# EasyEDA Pro project 光磁共振实验仪.eprj, board FD-OPMR-A3
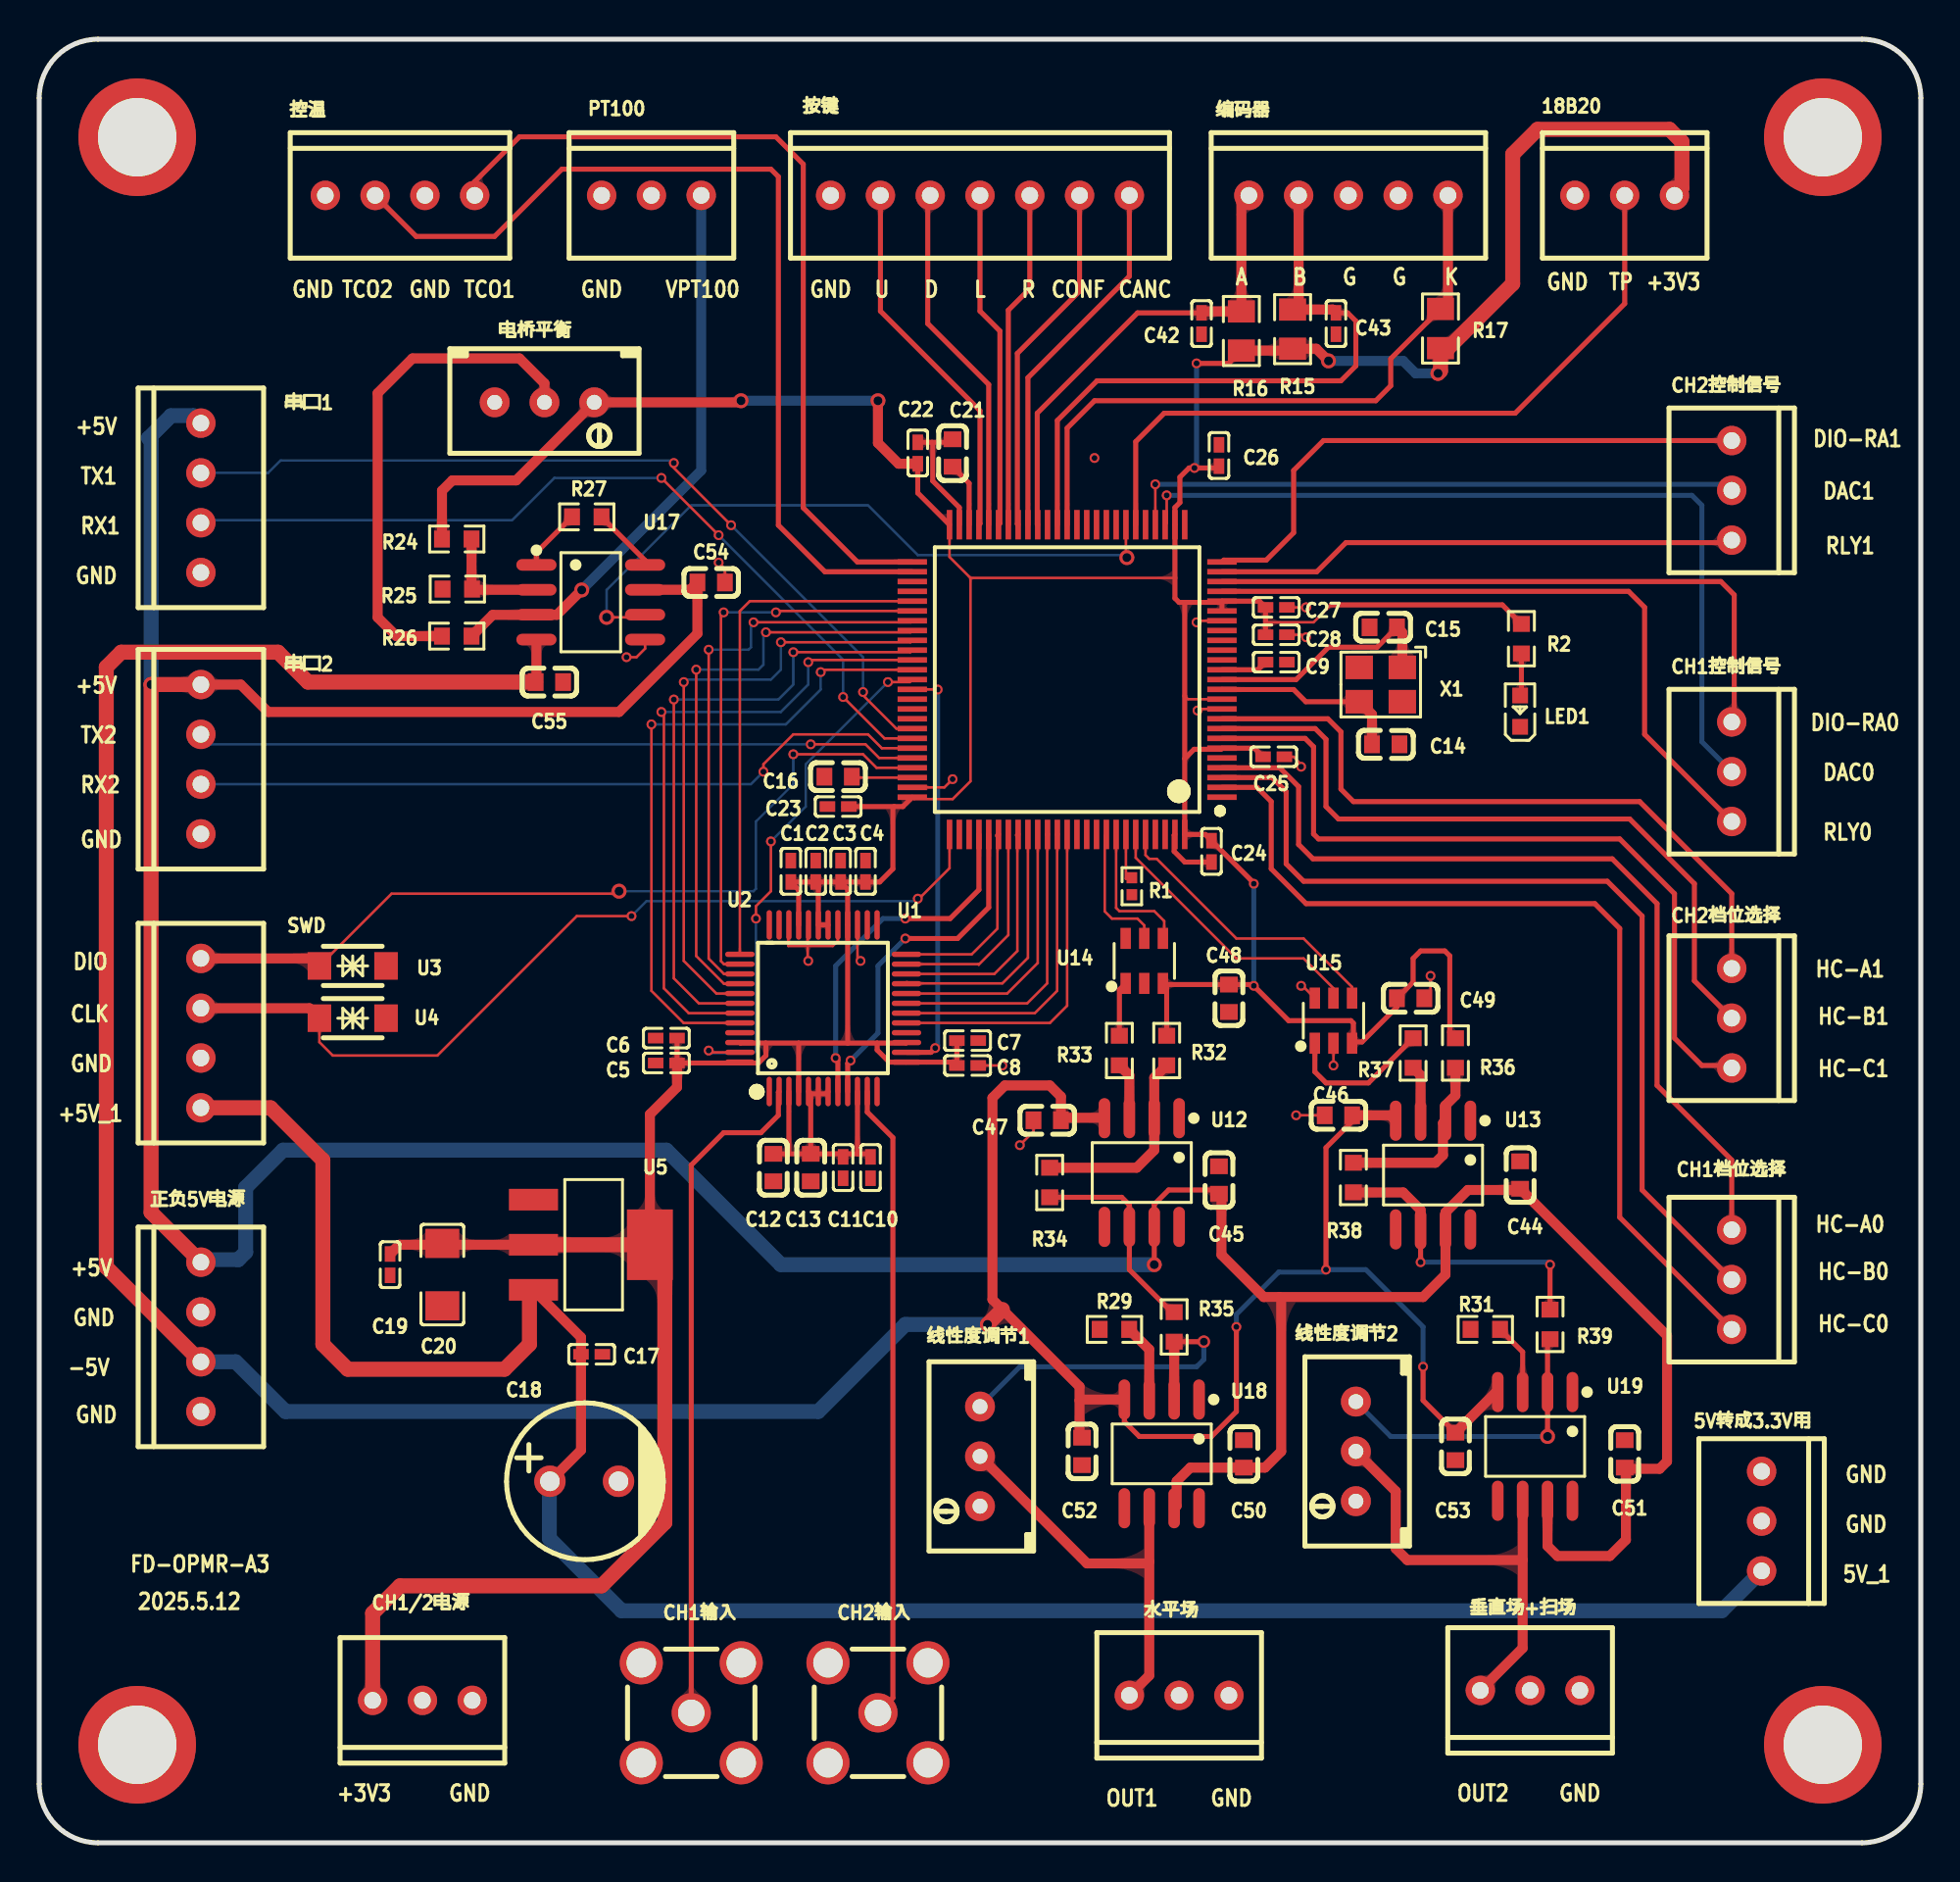
[diagram p7: board, top side]
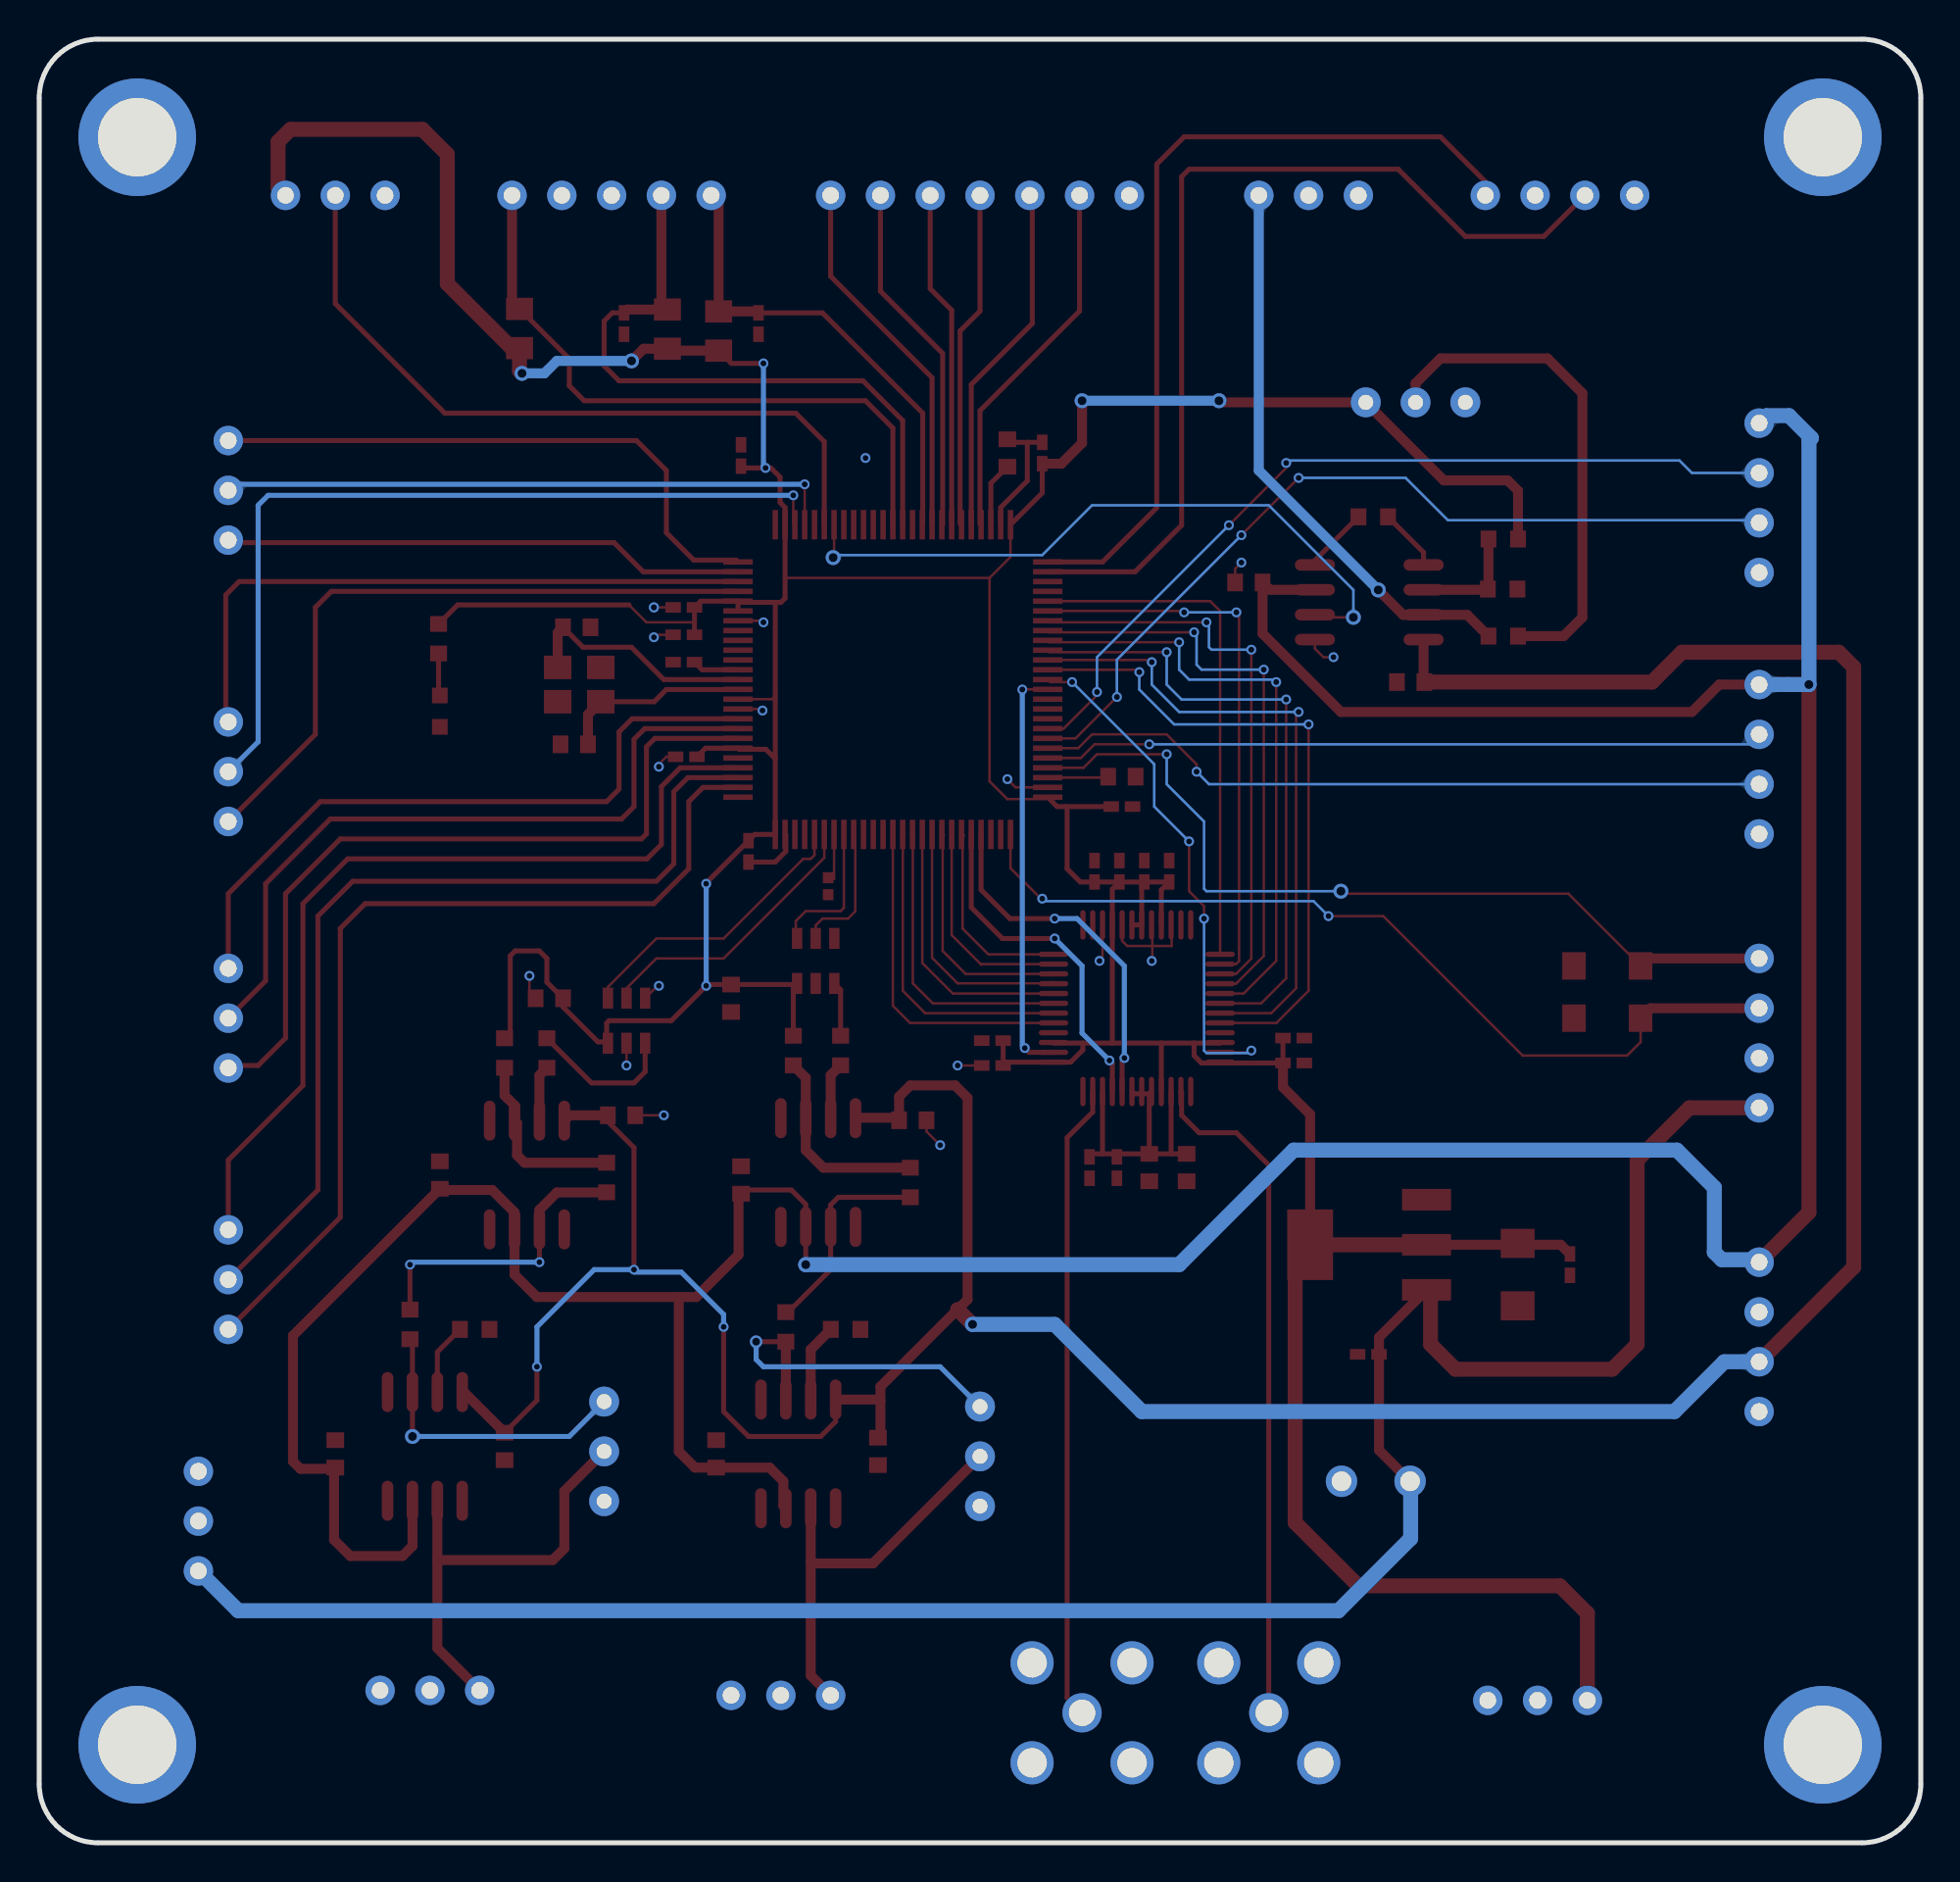
[diagram p8: board, bottom side, seen from below]

Outline 96 x 92 mm; copper layers: Top Layer, Bottom Layer. Coordinates in mm from the lower left corner of the outline.
Outline path: 0,89 0,3 arc(0.88,0.88) 3,0 93,0 arc(95.12,0.88) 96,3 96,89 arc(95.12,91.12) 93,92 3,92 arc(0.88,91.12) 0,89
Stack: Top Layer 0.035mm / Dielectric1 1.51mm FR4 er 4.5 / Bottom Layer 0.035mm

## Design rules (mm)
template: 自定义配置
spacing copperThickness1oz (default): track to track 0.102, other pairs 0.152 to 0.3
spacing copperThickness2oz: track to track 0.203, other pairs 0.152 to 0.3
track width copperThickness1oz (default): min 0.127, default 0.254, max 2.54
track width copperThickness2oz: min 0.203, default 0.254, max 2.54
track width VCCandGND: min 0.127, default 0.762, max 2.54
differential pair differentialPair (default): width min 0.127, default 0.254, max 2.54; gap min 0.152, default 0.152
via viaSize (default): diameter min 0.5, default 0.61, max 10; hole min 0.3, default 0.305, max 6.299

## Placement (name value [footprint] x y rotation side)
5V转成3.3V用  -  [CH2.54-3插座]  87.88 16.41 270 top
18B20  -  [CH2.54-3插座]  80.89 84.03 0 top
C1  100nF  [C0402]  38.35 49.56 270 top
C2  100nF  [C0402]  39.62 49.56 270 top
C3  100nF  [C0402]  40.89 49.56 270 top
C4  100nF  [C0402]  42.16 49.56 270 top
C5  100nF  [C0402]  32 39.78 0 top
C6  100nF  [C0402]  32 41.05 0 top
C7  100nF  [C0402]  47.37 40.92 180 top
C8  100nF  [C0402]  47.37 39.65 180 top
C9  100nF  [C0402]  63.11 60.22 0 top
C10  100nF  [C0402]  42.41 34.44 90 top
C11  100nF  [C0402]  41.01 34.44 90 top
C12  22uF  [C0603]  37.46 34.44 90 top
C13  22uF  [C0603]  39.36 34.44 90 top
C14  22pF  [C0603]  68.7 56.03 180 top
C15  22pF  [C0603]  68.57 62 0 top
C16  22uF  [C0603]  40.76 54.38 0 top
C17  100nF  [C0402]  28.19 24.92 180 top
C18  470uF  [cap-th_bd8.0-p3.50-d0.6-fd_1]  27.81 18.44 0 top
C19  100nF  [C0402]  17.9 29.49 90 top
C20  100uF  [C1206]  20.57 28.98 90 top
C21  22uF  [C0603]  46.6 70.89 90 top
C22  100nF  [C0402]  44.82 70.89 270 top
C23  100nF  [C0402]  40.76 52.86 0 top
C24  100nF  [C0402]  59.81 50.57 90 top
C25  100nF  [C0402]  62.99 55.4 180 top
C26  100nF  [C0402]  60.19 70.77 270 top
C27  100nF  [C0402]  63.11 63.02 180 top
C28  100nF  [C0402]  63.11 61.62 180 top
C42  100nF  [C0402]  59.3 77.5 90 top
C43  100nF  [C0402]  66.16 77.5 90 top
C44  100nF  [C0603]  75.56 34.06 270 top
C45  100nF  [C0603]  60.19 33.81 270 top
C46  100nF  [C0603]  66.29 37.11 0 top
C47  100nF  [C0603]  51.43 36.86 0 top
C48  100nF  [C0603]  60.7 43.08 90 top
C49  100nF  [C0603]  69.97 43.08 180 top
C50  100nF  [C0603]  61.46 19.84 270 top
C51  100nF  [C0603]  80.89 19.84 270 top
C52  100nF  [C0603]  53.21 19.97 90 top
C53  100nF  [C0603]  72.26 20.22 90 top
C54  100nF  [C0603]  34.28 64.29 180 top
C55  100nF  [C0603]  26.03 59.21 180 top
CH1/2电源  -  [CH2.54-3插座]  19.55 7.26 180 top
CH1控制信号  -  [CH2.54-3插座]  86.35 54.64 270 top
CH1档位选择  -  [CH2.54-3插座]  86.35 28.73 270 top
CH1输入  BWSMA-KE-Z001  [SMA-TH_BWSMA-KE-Z001]  33.27 6.63 0 top
CH2控制信号  -  [CH2.54-3插座]  86.35 68.99 270 top
CH2档位选择  -  [CH2.54-3插座]  86.35 42.06 270 top
CH2输入  BWSMA-KE-Z001  [SMA-TH_BWSMA-KE-Z001]  42.79 6.63 0 top
LED1  KT-0603R  [LED0603-RD]  75.56 57.72 90 top
NOREF  -  [Pad_e108]  91 87 0 top
NOREF#2  -  [Pad_e111]  91 5 0 top
NOREF#3  -  [Pad_e110]  5 5 0 top
NOREF#4  -  [Pad_e109]  5 87 0 top
PT100  PT100  [CH2.54-3插座]  31.24 84.03 0 top
R1  10kΩ  [R0402]  55.75 48.79 270 top
R2  5.1kΩ  [R0603]  75.62 61.42 270 top
R15  10kΩ  [R0805]  63.95 77.21 270 top
R16  10kΩ  [R0805]  61.34 77.11 270 top
R17  10kΩ  [R0805]  71.5 77.24 270 top
R24  200Ω  [R0603]  21.3 66.5 180 top
R25  100Ω  [R0603]  21.33 63.95 0 top
R26  20Ω  [R0603]  21.3 61.55 180 top
R27  6.2kΩ  [R0603]  27.94 67.64 180 top
R29  510Ω  [R0603]  54.86 26.19 0 top
R31  510Ω  [R0603]  73.78 26.19 0 top
R32  1kΩ  [R0603]  57.53 40.41 270 top
R33  1kΩ  [R0603]  55.11 40.41 270 top
R34  1kΩ  [R0603]  51.56 33.68 270 top
R35  1kΩ  [R0603]  57.91 26.31 270 top
R36  1kΩ  [R0603]  72.26 40.28 270 top
R37  1kΩ  [R0603]  70.1 40.28 270 top
R38  1kΩ  [R0603]  67.05 33.94 270 top
R39  1kΩ  [R0603]  77.08 26.44 270 top
SWD  SWD  [CH2.54-4插座]  8.25 41.3 90 top
U1  STM32H750VBT6TR  [QFP-100_L14.0-W14.0-P0.50-LS16.0-BL]  52.44 59.33 90 top
U2  AD9288BSTZ-100  [LQFP-48_L7.0-W7.0-P0.50-LS9.0-BL]  40 42.57 0 top
U3  SMF7.5CA  [SOD-123FL_L2.8-W1.8-LS3.7-BI]  16 44.73 0 top
U4  SMF7.5CA  [SOD-123FL_L2.8-W1.8-LS3.7-BI]  16 42.06 0 top
U5  AMS1117-3.3  [SOT-223-3_L6.5-W3.4-P2.30-LS7.0-BR]  28.19 30.51 180 top
U12  OP07CDR  [SOIC-8_L4.9-W3.9-P1.27-LS6.0-BL]  56.25 34.19 180 top
U13  OP07CDR  [SOIC-8_L4.9-W3.9-P1.27-LS6.0-BL]  71.11 34.06 180 top
U14  MCP4725A0T-E/CH  [SOT-23-6_L2.9-W1.6-P0.95-LS2.8-BL]  56.38 44.98 0 top
U15  MCP4725A0T-E/CH  [SOT-23-6_L2.9-W1.6-P0.95-LS2.8-BL]  66.03 41.94 0 top
U17  AD620ARZ  [SOIC-8_L4.9-W3.9-P1.27-LS6.0-BL]  28.14 63.28 270 top
U18  OP07CDR  [SOIC-8_L4.9-W3.9-P1.27-LS6.0-BL]  57.27 19.84 180 top
U19  OP07CDR  [SOIC-8_L4.9-W3.9-P1.27-LS6.0-BL]  76.32 20.22 180 top
X1  25MHz  [OSC-SMD_4P-L3.2-W2.5-BL]  68.45 59.08 180 top
串口1  -  [CH2.54-4插座]  8.25 68.61 90 top
串口2  -  [CH2.54-4插座]  8.25 55.27 90 top
垂直场+扫场  -  [CH2.54-3插座]  76.07 7.77 180 top
按键  -  [CH2.54-7插座]  48 84.03 0 top
控温  -  [CH2.54-4插座]  18.41 84.03 0 top
正负5V电源  -  [CH2.54-4插座]  8.25 25.81 90 top
水平场  -  [CH2.54-3插座]  58.16 7.52 180 top
电桥平衡  500Ω  [RES-ADJ-TH_3296W]  25.78 73.48 270 top
线性度调节1  2kΩ  [RES-ADJ-TH_3296W]  48 19.71 180 top
线性度调节2  2kΩ  [RES-ADJ-TH_3296W]  67.18 19.97 180 top
编码器  -  [CH2.54-5插座]  66.8 84.03 0 top

## Footprints (pads in the part's own frame, mm; a bottom-side part is the same pattern mirrored in y, then rotated)
C0402
  rect 0.79x0.54 smd: 1(-0.545,0) 2(0.545,0)
C0603
  rect 0.8x0.9 smd: 1(-0.7,0) 2(0.7,0)
C1206
  rect 1.485x1.728 smd: 1(-1.593,0) 2(1.593,0)
cap-th_bd8.0-p3.50-d0.6-fd_1
  round 1.6 hole 1: 1(-1.75,0) 2(1.75,0)
CH2.54-3插座
  round 1.5 hole 0.85: 1(-2.54,0) 2(0,0) 3(2.54,0)
CH2.54-4插座
  round 1.5 hole 0.85: 1(-3.81,0) 2(-1.27,0) 3(1.27,0) 4(3.81,0)
CH2.54-5插座
  round 1.5 hole 0.85: 1(-5.08,0) 2(-2.54,0) 3(0,0) 4(2.54,0) 5(5.08,0)
CH2.54-7插座
  round 1.5 hole 0.85: 1(-7.62,0) 2(-5.08,0) 3(-2.54,0) 4(0,0) 5(2.54,0) 6(5.08,0) 7(7.62,0)
LED0603-RD
  rect 0.8x0.8 smd: 1(-0.799,0) 2(0.799,0)
LQFP-48_L7.0-W7.0-P0.50-LS9.0-BL
  oval 0.27x1.5 smd: 1(-2.75,-4.25) 2(-2.25,-4.25) 3(-1.75,-4.25) 4(-1.25,-4.25) 5(-0.75,-4.25) 6(-0.25,-4.25) 7(0.25,-4.25) 8(0.75,-4.25) 9(1.25,-4.25) 10(1.75,-4.25) 11(2.25,-4.25) 12(2.75,-4.25) 25(2.75,4.25) 26(2.25,4.25) 27(1.75,4.25) 28(1.25,4.25) 29(0.75,4.25) 30(0.25,4.25) 31(-0.25,4.25) 32(-0.75,4.25) 33(-1.25,4.25) 34(-1.75,4.25) 35(-2.25,4.25) 36(-2.75,4.25)
  oval 1.5x0.27 smd: 13(4.25,-2.75) 14(4.25,-2.25) 15(4.25,-1.75) 16(4.25,-1.25) 17(4.25,-0.75) 18(4.25,-0.25) 19(4.25,0.25) 20(4.25,0.75) 21(4.25,1.25) 22(4.25,1.75) 23(4.25,2.25) 24(4.25,2.75) 37(-4.25,2.75) 38(-4.25,2.25) 39(-4.25,1.75) 40(-4.25,1.25) 41(-4.25,0.75) 42(-4.25,0.25) 43(-4.25,-0.25) 44(-4.25,-0.75) 45(-4.25,-1.25) 46(-4.25,-1.75) 47(-4.25,-2.25) 48(-4.25,-2.75)
OSC-SMD_4P-L3.2-W2.5-BL
  rect 1.4x1.2 smd: 1(-1.1,-0.875) 2(1.1,-0.875) 3(1.1,0.875) 4(-1.1,0.875)
Pad_e108
  round 6 hole 4: 2(0,0)
Pad_e109
  round 6 hole 4: 2(0,0)
Pad_e110
  round 6 hole 4: 2(0,0)
Pad_e111
  round 6 hole 4: 2(0,0)
QFP-100_L14.0-W14.0-P0.50-LS16.0-BL
  rect 0.28x1.5 smd: 1(-6,-7.9) 2(-5.5,-7.9) 3(-5,-7.9) 4(-4.5,-7.9) 5(-4,-7.9) 6(-3.5,-7.9) 7(-3,-7.9) 8(-2.5,-7.9) 9(-2,-7.9) 10(-1.5,-7.9) 11(-1,-7.9) 12(-0.5,-7.9) 13(0,-7.9) 14(0.5,-7.9) 15(1,-7.9) 16(1.5,-7.9) 17(2,-7.9) 18(2.5,-7.9) 19(3,-7.9) 20(3.5,-7.9) 21(4,-7.9) 22(4.5,-7.9) 23(5,-7.9) 24(5.5,-7.9) 25(6,-7.9) 51(6,7.9) 52(5.5,7.9) 53(5,7.9) 54(4.5,7.9) 55(4,7.9) 56(3.5,7.9) 57(3,7.9) 58(2.5,7.9) 59(2,7.9) 60(1.5,7.9) 61(1,7.9) 62(0.5,7.9) 63(0,7.9) 64(-0.5,7.9) 65(-1,7.9) 66(-1.5,7.9) 67(-2,7.9) 68(-2.5,7.9) 69(-3,7.9) 70(-3.5,7.9) 71(-4,7.9) 72(-4.5,7.9) 73(-5,7.9) 74(-5.5,7.9) 75(-6,7.9)
  rect 1.5x0.28 smd: 26(7.9,-6) 27(7.9,-5.5) 28(7.9,-5) 29(7.9,-4.5) 30(7.9,-4) 31(7.9,-3.5) 32(7.9,-3) 33(7.9,-2.5) 34(7.9,-2) 35(7.9,-1.5) 36(7.9,-1) 37(7.9,-0.5) 38(7.9,0) 39(7.9,0.5) 40(7.9,1) 41(7.9,1.5) 42(7.9,2) 43(7.9,2.5) 44(7.9,3) 45(7.9,3.5) 46(7.9,4) 47(7.9,4.5) 48(7.9,5) 49(7.9,5.5) 50(7.9,6) 76(-7.9,6) 77(-7.9,5.5) 78(-7.9,5) 79(-7.9,4.5) 80(-7.9,4) 81(-7.9,3.5) 82(-7.9,3) 83(-7.9,2.5) 84(-7.9,2) 85(-7.9,1.5) 86(-7.9,1) 87(-7.9,0.5) 88(-7.9,0) 89(-7.9,-0.5) 90(-7.9,-1) 91(-7.9,-1.5) 92(-7.9,-2) 93(-7.9,-2.5) 94(-7.9,-3) 95(-7.9,-3.5) 96(-7.9,-4) 97(-7.9,-4.5) 98(-7.9,-5) 99(-7.9,-5.5) 100(-7.9,-6)
R0402
  rect 0.566x0.54 smd: 1(-0.433,0) 2(0.433,0)
R0603
  rect 0.806x0.864 smd: 1(-0.753,0) 2(0.753,0)
R0805
  rect 1.133x1.377 smd: 1(-1,0) 2(1,0)
RES-ADJ-TH_3296W
  round 1.524 hole 0.762: 1(0,2.54) 2(0,0) 3(0,-2.54)
SMA-TH_BWSMA-KE-Z001
  round 2.2 hole 1.5: 1(-2.55,-2.55) 2(-2.55,2.55) 3(2.55,2.55) 4(2.55,-2.55)
  round 2 hole 1.35: 5(0,0)
SOD-123FL_L2.8-W1.8-LS3.7-BI
  rect 1.2x1.4 smd: 1(-1.7,0) 2(1.7,0)
SOIC-8_L4.9-W3.9-P1.27-LS6.0-BL
  oval 0.588x2.045 smd: 1(-1.905,-2.772) 2(-0.635,-2.772) 3(0.635,-2.772) 4(1.905,-2.772) 5(1.905,2.772) 6(0.635,2.772) 7(-0.635,2.772) 8(-1.905,2.772)
SOT-23-6_L2.9-W1.6-P0.95-LS2.8-BL
  rect 0.532x1.072 smd: 1(-0.95,-1.149) 2(0,-1.149) 3(0.95,-1.149) 4(0.95,1.149) 5(0,1.149) 6(-0.95,1.149)
SOT-223-3_L6.5-W3.4-P2.30-LS7.0-BR
  rect 2.5x1.1 smd: 1(2.97,-2.3) 2(2.97,0) 3(2.97,2.3)
  rect 2.34x3.6 smd: 4(-2.97,0)

## Nets
As in the schematic, except:
+5V_1: 5V转成3.3V用.3 C17.2 C18.1 SWD.1 U5.3
GND: 5V转成3.3V用.1 5V转成3.3V用.2 18B20.1 C1.1 C2.1 C3.1 C4.1 C5.1 C6.1 C7.1 C8.1 C9.2 C10.1 C11.1 C12.1 C13.1 C14.1 C15.1 C16.1 C17.1 C18.2 C19.1 C20.1 C21.2 C22.1 C23.1 C24.1 C25.1 C26.1 C27.1 C28.1 C42.1 C43.1 C44.1 C45.1 C46.1 C47.1 C48.1 C49.1 C50.1 C51.1 C52.1 C53.1 C54.1 C55.1 CH1/2电源.1 CH1/2电源.2 CH1输入.1 CH1输入.2 CH1输入.3 CH1输入.4 CH2输入.1 CH2输入.2 CH2输入.3 CH2输入.4 LED1.1 NOREF.2 NOREF#2.2 NOREF#3.2 NOREF#4.2 PT100.1 PT100.2 R1.2 R25.1 R29.1 R31.1 SWD.2 U1.10 U1.19 U1.26 U1.49 U1.74 U1.99 U2.1 U2.12 U2.16 U2.27 U2.29 U2.32 U2.34 U2.45 U3.2 U4.2 U5.1 U14.2 U14.6 U15.2 U15.6 U17.5 X1.2 X1.4 串口1.1 串口2.1 垂直场+扫场.1 垂直场+扫场.2 按键.1 控温.1 控温.3 正负5V电源.1 正负5V电源.3 水平场.1 水平场.2 编码器.3 编码器.4
CLK: SWD.3 U1.76 U4.1
DIO: SWD.4 U1.72 U3.1
HC-A0: CH1档位选择.1 U1.4
HC-A1: CH2档位选择.1 U1.9
HC-C0: CH1档位选择.3 U1.2
HC-C1: CH2档位选择.3 U1.7

Pads without a net: U1 1 5 15 16 17 18 33 34 35 36 37 40 53 54 65 66 67 77 78 89 90 91 97 98; U2 25 26 35 36; U12 1 5 8; U13 1 5 8; U18 1 5 8; U19 1 5 8; 电桥平衡 3; 线性度调节1 1; 线性度调节2 1

## Via types
v1: diameter 0.5, hole 0.3, Top Layer to Bottom Layer, 33 vias
v2: diameter 0.5, hole 0.305, Top Layer to Bottom Layer, 31 vias
v3: diameter 0.762, hole 0.457, Top Layer to Bottom Layer, 12 vias
v4: diameter 0.635, hole 0.406, Top Layer to Bottom Layer, 1 via

## Routing (per net, layer and track width the routed paths; a pad name or vN(x,y) marks a point on that pad's centre or on a via; arc(x,y) is an arc through that point)
+3V3: length 298.4
  Top Layer w0.127: 58.44,58.5 58.61,58.33 U1.11 ; 47.51,64.52 57.94,64.52 ; 47.51,64.52 47.51,54.15 46.6,53.24 44.64,53.24 U1.75 ; 47.51,64.52 46.44,65.59 U1.50 ; 65.91,63.14 65.02,62.26 62.62,62.26 62.57,62.31
  Top Layer w0.254: 35.71,39.78 36.7,39.78 37.08,40.16 37.08,40.78 37.07,40.79 ; 35.71,39.78 U2.48 ; 35.71,39.78 32.54,39.78 32.54,41.05 ; 43.62,52.86 41.05,52.86 ; 43.62,52.86 44.07,52.86 U1.75 ; 43.62,52.86 43.56,52.8 43.56,49.68 42.88,49.01 C4.2 C3.2 ; 57.39,43.78 57.53,43.64 R32.1 ; 57.39,43.78 C48.2 61.91,43.78 v1(61.97,43.71) 63.75,41.94 66.92,41.94 67.05,41.81 67.05,40.85 ; 57.39,43.78 U14.3 ; U2.30 U2.31 39.75,48.88 C2.2 ; C28.2 C27.2 62.25,63.33 U1.21 ; 58.44,55.3 58.92,55.78 60.29,55.78 U1.6 62,55.83 C25.2 ; 58.44,55.3 58.44,63.25 58.46,63.27 ; 58.44,55.3 58.44,51.44 59.49,51.44 C24.2 61.97,48.96 v1(61.97,48.92) ; 42.75,40.79 44.22,40.79 U2.15 ; 42.75,40.79 41.25,40.79 ; 42.75,40.79 42.75,40.44 43.37,39.82 U2.13 46.65,39.82 C8.2 C7.2 ; 38.75,40.79 41.25,40.79 ; 38.75,40.79 37.07,40.79 ; 38.75,40.79 U2.4 ; 41.25,40.79 U2.28 41.25,48.65 C3.2 ; C2.2 C3.2 ; C2.2 C1.2 38.75,48.61 U2.33 ; U1.21 U1.20 ; U1.21 60.28,63.27 58.46,63.27 ; 65.91,63.14 74.65,63.14 R2.1 ; 37.07,40.79 35.78,40.79 U2.46 ; 67.05,40.85 U15.3 ; 67.05,40.85 67.49,40.85 69.27,42.63 69.27,43.07 ; C22.2 44.82,68.86 U1.50 ; 58.46,63.27 58.16,63.27 57.94,63.49 U1.27 57.94,68.11 58.2,68.37 58.2,69.66 58.67,70.13 v2(58.94,70.13) 60.1,70.13 C26.2 ; v2(59.05,75.46) 60.68,75.46 R16.2 ; 69.27,43.07 70.1,43.9 70.1,45.11 70.48,45.49 71.72,45.49 71.97,45.24 71.97,41.33 R36.1 ; 69.27,43.07 C49.2
  Top Layer w0.508: v3(35.81,73.56) 35.73,73.48 电桥平衡.1 24.34,69.5 21.08,69.5 20.55,68.97 R24.2 ; v3(65.78,75.59) 65.16,76.21 R15.2 63.85,76.11 R16.2 ; U5.4 31.16,37.16 32.54,38.54 32.54,39.78 ; U5.2 18.37,30.51 C19.2 ; C22.2 43.85,70.35 42.79,71.4 v3(42.79,73.56)
  Top Layer w0.762: 18B20.3 83.81,84.41 83.81,86.77 83.18,87.4 76.45,87.4 75.18,86.13 75.18,79.53 71.89,76.24 R17.2 71.5,75.08 v3(71.37,74.96) ; U5.2 U5.4 31.92,29.74 31.92,16.33 28.7,13.11 18.41,13.11 17.01,11.71 CH1/2电源.3
  Bottom Layer w0.254: v2(59.05,75.46) 59.05,70.24 v2(58.94,70.13) ; v1(61.97,48.92) v1(61.97,43.71)
  Bottom Layer w0.508: v3(35.81,73.56) v3(42.79,73.56) ; v3(71.37,74.96) 70.22,74.96 69.59,75.59 v3(65.78,75.59)
+5V: length 215.2
  Top Layer w0.254: v3(56.89,29.49) U12.7 56.89,32.57 57.62,33.3 60,33.3 C45.2
  Top Layer w0.508: C45.2 60.32,32.98 60.32,30 62.48,27.84 63.28,27.84 ; 80.96,19.08 82.67,19.08 83.05,19.46 83.05,25.87 C44.2 75.5,33.3 72.89,33.3 71.75,32.16 U13.7 71.75,28.98 70.61,27.84 63.28,27.84 ; 80.96,19.08 80.96,15.46 80.13,14.63 77.46,14.63 76.96,15.14 U19.7 ; 80.96,19.08 C51.2 ; 63.28,27.84 63.37,27.75 63.37,19.97 62.54,19.14 C50.2 58.73,19.14 58.03,18.44 58.03,17.19 U18.7 ; U17.7 33.21,63.92 C54.2 33.58,61.68 29.59,57.68 11.68,57.68 10.28,59.08 串口2.4
  Top Layer w0.762: 正负5V电源.4 5.71,32.16 v3(5.71,59.08) 串口2.4
  Bottom Layer w0.762: 串口1.4 7.87,72.8 6.72,72.8 5.58,71.65 5.71,71.53 v3(5.71,59.08) 串口2.4 ; 正负5V电源.4 8.38,29.74 10.15,29.74 10.53,30.12 10.53,33.43 12.44,35.33 32,35.33 37.84,29.49 v3(56.89,29.49)
+5V_1: length 109.8
  Top Layer w0.508: C18.1 27.64,20.03 C17.2 27.64,25.78 U5.3
  Top Layer w0.762: SWD.1 11.81,37.49 14.47,34.82 14.47,25.43 15.74,24.16 23.74,24.16 25.01,25.43 25.01,28 U5.3
  Bottom Layer w0.762: C18.1 26.03,18.41 26.03,15.52 29.71,11.84 85.85,11.84 5V转成3.3V用.3
-5V: length 179.7
  Top Layer w0.254: v1(61.08,26.31) 61.08,22 59.81,20.73 56.13,20.73 55.37,21.49 U18.4 ; v1(65.65,29.24) 65.65,35.46 66.99,36.79 C46.2 ; v1(70.61,24.28) 70.61,22.57 72.26,20.92
  Top Layer w0.508: C55.2 25.37,59.25 U17.4 ; C52.2 53.08,20.79 53.08,22.56 ; 53.08,22.56 53.13,22.61 U18.4 ; 53.08,22.56 53.08,23.27 48.63,27.71 48.63,38 49.27,38.63 51.56,38.63 52.13,38.06 C47.2 52.26,36.98 54.33,36.98 U12.4 ; U19.4 74.33,22.99 72.26,20.92 ; C46.2 68.93,37.11 U13.4
  Top Layer w0.762: v3(48.38,26.44) 49.14,27.2 ; C55.2 13.71,59.21 12.19,60.73 4.19,60.73 3.42,59.97 3.42,29.36 正负5V电源.2
  Bottom Layer w0.254: v1(61.08,26.31) 61.08,26.95 63.24,29.11 65.65,29.11 ; v1(70.61,24.28) 70.61,26.31 67.69,29.24 v1(65.65,29.24)
  Bottom Layer w0.762: v3(48.38,26.44) 44.19,26.44 39.75,22 12.57,22 10.03,24.54 正负5V电源.2
GND: length 36
  Top Layer w0.127: U1.19 59.13,62.33 v2(59.05,62.26) ; 29.84,60.48 v1(29.97,60.48) 30.47,60.48 30.91,60.92 U17.5 ; C54.1 34.98,64.98 v1(34.66,65.3) ; v1(39.24,44.98) 39.21,45.01 39.21,45.75 ; v1(70.99,44.22) 70.99,43.39 C49.1 ; U15.2 v1(66.03,39.65) ; U2.29 40.75,46.01 40.49,45.75 39.21,45.75 ; 41.78,44.98 41.75,45.01 U2.27 ; 65.08,43.08 64.46,43.71 v1(64.38,43.71) ; v1(50.03,35.59) 50.73,36.28 C47.1 ; 39.21,45.75 38.22,45.75 38.22,46.79 U2.34 ; 39.21,45.75 39.21,46.78 U2.32 ; 64.26,55.14 64,55.4 63.53,55.4 ; C46.1 v1(64.13,37.11) ; v1(46.6,54.25) 46.18,53.83 U1.74 ; U1.10 59.18,57.83 ; C8.1 v1(49.14,39.65) ; C27.1 v1(64.64,63.02) ; C28.1 64.38,61.62 64.64,61.37
  Top Layer w0.254: 45.55,71.44 45.59,71.4 45.59,69.47 46.94,68.11 U1.49 ; 45.55,71.44 C22.1 ; 45.55,71.44 46.45,71.44 C21.2 ; 57.94,51.44 57.91,51.4 57.91,50.57 58.45,50.03 C24.1
  vias: v1(41.9,44.98) v1(53.84,70.64) v1(64.38,54.89) v1(64.64,61.49) v2(59.1,57.76)
A: length 24.3
  Top Layer w0.254: U1.41 50.92,67.26 50.92,72.92 56.04,78.04 C42.2
  Top Layer w0.508: 编码器.1 61.34,83.65 R16.1 59.38,78.11 C42.2
AD1: length 34.4
  Top Layer w0.127: U1.32 55.44,65.61 v3(55.49,65.56) ; v3(28.95,62.51) 30.78,62.51 U17.6
  Bottom Layer w0.127: 55.37,65.69 44.82,65.69 42.28,68.22 33.27,68.22 28.95,63.91 v3(28.95,62.51)
B: length 33.4
  Top Layer w0.254: C43.2 66.76,78.04 67.18,77.62 67.18,75.34 66.41,74.58 53.97,74.58 51.94,72.55 U1.39
  Top Layer w0.508: 编码器.2 64.26,78.52 R15.1 65.99,78.21 C43.2
CANCEL: length 18.9
  Top Layer w0.254: 按键.7 55.62,79.91 50.44,74.73 U1.42
CH1-OUT: length 34.7
  Top Layer w0.254: CH1输入.5 33.27,34.57 34.92,36.22 36.82,36.22 37.71,37.11 37.71,38.28 U2.2
CH2-OUT: length 32.5
  Top Layer w0.254: CH2输入.5 43.56,7.39 43.56,35.97 42.25,37.27 U2.11
CLK: length 45.6
  Top Layer w0.127: v1(30.22,47.27) 27.43,47.27 20.31,40.16 14.98,40.16 14.3,40.84 U4.1 ; v1(44.82,48.16) 44.89,48.16 46.44,49.71 46.44,51.44
  Top Layer w0.508: U4.1 13.79,42.57 SWD.3
  Bottom Layer w0.127: v1(30.22,47.27) 30.98,48.03 44.7,48.03 v1(44.82,48.16)
CONFIRM: length 18.1
  Top Layer w0.254: 按键.6 53.08,79.15 49.91,75.97 49.91,67.28 U1.43
DA0: length 26.5
  Top Layer w0.127: U1.55 36.25,63.33 35.75,62.83 U2.37
DA1: length 28.5
  Top Layer w0.127: U2.38 34.94,44.82 34.78,44.97 34.78,62.63 v2(34.92,62.76) ; U1.56 37.66,62.83 v2(37.59,62.76)
  Bottom Layer w0.127: v2(37.59,62.76) v2(34.92,62.76)
DA2: length 29.4
  Top Layer w0.127: U1.57 44.47,62.26 v2(36.44,62.26) ; v2(34.16,60.86) 34.16,45.1 34.94,44.32 U2.39
  Bottom Layer w0.127: v2(34.16,60.86) 36.19,60.86 36.32,60.99 36.32,62.38
DA3: length 30.2
  Top Layer w0.127: v2(33.52,59.84) 33.52,45.23 34.94,43.82 U2.40 ; U1.58 44.46,61.75 v2(37.08,61.75)
  Bottom Layer w0.127: v2(33.52,59.84) 36.7,59.84 36.95,60.1 36.95,61.62 v2(37.08,61.75)
DA4: length 31.3
  Top Layer w0.127: 37.71,61.24 v2(37.84,61.24) 44.45,61.24 U1.59 ; U2.41 34.55,43.32 32.89,44.98 v2(32.89,59.21)
  Bottom Layer w0.127: v2(37.84,61.24) 37.84,59.84 37.33,59.33 33.01,59.33 v2(32.89,59.21)
DA5: length 32.3
  Top Layer w0.127: v2(38.47,60.73) 44.44,60.73 U1.60 ; U2.42 33.65,42.82 32.38,44.09 v2(32.38,58.32)
  Bottom Layer w0.127: v2(38.47,60.73) 38.47,59.08 37.71,58.32 v2(32.38,58.32)
DA6: length 33.1
  Top Layer w0.127: v2(31.74,57.68) 31.87,57.56 31.87,43.59 33.14,42.32 U2.43 ; v2(39.24,60.22) 39.35,60.33 U1.61
  Bottom Layer w0.127: v2(31.74,57.68) 37.84,57.68 39.24,59.08 v2(39.24,60.22)
DA7: length 33.8
  Top Layer w0.127: U1.62 39.99,59.83 v2(39.87,59.72) ; v2(31.24,57.05) 31.24,43.46 32.88,41.82 U2.44
  Bottom Layer w0.127: v2(31.24,57.05) 38.09,57.05 39.87,58.83 v2(39.87,59.72)
DAC0: length 43.3
  Top Layer w0.127: U1.28 57.53,67.31 v2(57.53,68.73)
  Bottom Layer w0.254: v2(57.53,68.73) 84.32,68.73 84.83,68.22 84.83,56.16 CH1控制信号.2
DAC1: length 31.7
  Top Layer w0.127: U1.29 v2(56.94,69.3)
  Top Layer w0.254: v2(56.94,69.3) 57.02,69.37
  Bottom Layer w0.254: CH2控制信号.2 86.04,69.3 v2(56.94,69.3)
DAC2: length 2.8
  Top Layer w0.254: R33.1 55.11,43.52 U14.1
DAC3: length 7.7
  Top Layer w0.254: U15.1 65.08,39.33 65.65,38.76 67.82,38.76 R37.1
DB0: length 10
  Top Layer w0.127: 48.89,51.38 48.89,46.64 47.57,45.32 U2.24
  Top Layer w0.254: 48.89,51.38 48.94,51.44
DB1: length 11
  Top Layer w0.127: U2.23 47.91,44.82 47.94,44.79 49.44,46.3 49.44,51.44
DB2: length 12.1
  Top Layer w0.127: 49.91,51.39 49.91,45.49 48.73,44.32 U2.22
  Top Layer w0.254: 49.91,51.39 49.94,51.44
DB3: length 13
  Top Layer w0.127: 50.44,51.44 50.44,45.14 49.14,43.84 44.27,43.84
  Top Layer w0.254: 44.27,43.84 U2.21
DB4: length 13.9
  Top Layer w0.127: U2.20 49.38,43.32 50.94,44.88 50.94,51.44
DB5: length 15.2
  Top Layer w0.127: 51.43,51.42 51.43,43.84 50.41,42.82 U2.19
  Top Layer w0.254: 51.43,51.42 51.44,51.44
DB6: length 16.1
  Top Layer w0.127: 51.94,51.43 51.94,43.46 50.8,42.32 U2.18
  Top Layer w0.254: 51.94,51.43 51.94,51.44
DB7: length 17.3
  Top Layer w0.127: 52.44,51.44 52.44,42.7 51.57,41.82 U2.17
DIO: length 44.1
  Top Layer w0.127: 29.59,48.41 17.98,48.41 U3.1 ; v2(38.47,55.53) 42.03,55.53 42.72,54.83 U1.72
  Top Layer w0.508: U3.1 13.92,45.11 SWD.4
  Bottom Layer w0.127: v2(38.47,55.53) 38.47,54 36.57,52.1 36.57,48.67 36.44,48.54 v3(29.59,48.54)
DIO-CLKA: length 27
  Top Layer w0.127: U1.63 44.42,59.21 v2(43.3,59.21) ; v1(36.57,47.14) 36.57,47.78 37.33,48.54 v1(37.33,51.08) ; v1(34.16,40.41) 34.25,40.32 U2.47
  Bottom Layer w0.127: v1(37.33,51.08) 39.11,52.86 39.11,55.02 v2(43.3,59.21) ; 34.16,40.28 36.44,40.28 36.57,40.41 v1(36.57,47.14)
DIO-CLKB: length 21.2
  Top Layer w0.127: U1.64 45.83,58.83 v2(45.84,58.83)
  Top Layer w0.254: U2.14 45.5,40.32 v1(45.71,40.54)
  Bottom Layer w0.254: v2(45.84,58.83) 45.84,40.67 v1(45.71,40.54)
DIO-RA0: length 32.9
  Top Layer w0.254: CH1控制信号.1 86.48,57.3 86.48,63.65 85.8,64.33 U1.23
DIO-RA1: length 30.4
  Top Layer w0.254: CH2控制信号.1 65.53,71.53 64,70 64,66.83 62.6,65.43 60.44,65.43 U1.25
DIO-S1: length 18.2
  Top Layer w0.254: 47.94,51.44 47.94,48.61 46.48,47.14 v1(44.19,47.14) ; v1(40.63,40.03) 40.75,39.92 U2.8
  Bottom Layer w0.254: v1(44.19,47.14) 43.05,47.14 40.63,44.73 v1(40.63,40.03)
DIO-S2: length 17.7
  Top Layer w0.254: v1(44.19,46.13) 46.86,46.13 48.44,47.72 48.44,51.44 ; U2.9 41.25,39.76 v1(41.4,39.9)
  Bottom Layer w0.254: v1(41.4,39.9) 42.79,41.3 42.79,44.73 v1(44.19,46.13)
DOWN: length 18.1
  Top Layer w0.254: 按键.3 45.33,83.91 45.33,77.5 48.44,74.38 U1.46
HC-A0: length 45
  Top Layer w0.254: CH1档位选择.1 86.35,34.82 82.54,38.63 82.54,47.91 80.26,50.19 64.99,50.19 64.26,50.92 64.26,53.87 63.29,54.83 U1.4
HC-A1: length 35.2
  Top Layer w0.254: U1.9 65.75,57.33 66.41,56.67 66.41,53.75 67.05,53.11 81.66,53.11 86.35,48.41 CH2档位选择.1
HC-B0: length 47
  Top Layer w0.254: U1.3 62.91,54.33 63.62,53.62 63.62,49.94 64.51,49.05 80,49.05 81.78,47.27 81.78,33.3 CH1档位选择.2
HC-B1: length 37
  Top Layer w0.254: CH2档位选择.2 84.45,43.97 84.45,48.92 81.15,52.22 66.29,52.22 65.65,52.86 65.65,56.29 65.1,56.83 U1.8
HC-C0: length 48.1
  Top Layer w0.254: U1.2 62.14,53.83 62.86,53.11 62.86,49.68 64.64,47.91 79.37,47.91 80.64,46.64 80.64,31.9 CH1档位选择.3
HC-C1: length 39.9
  Top Layer w0.254: U1.7 64.59,56.33 65.02,55.91 65.02,51.46 65.27,51.21 80.64,51.21 83.43,48.41 83.43,41.05 84.83,39.65 86.23,39.65 CH2档位选择.3
KEY: length 33.3
  Top Layer w0.254: R17.1 68.96,75.7 68.96,74.32 68.19,73.56 53.84,73.56 52.44,72.16 U1.38
  Top Layer w0.508: R17.1 71.88,78.62 编码器.5
LEFT: length 17.2
  Top Layer w0.254: 按键.4 48,78.13 49.02,77.11 49.02,67.31 U1.45
OSC_IN: length 9.7
  Top Layer w0.254: X1.3 64.62,58.21 64,58.83 60.35,58.83 U1.12
  Top Layer w0.508: X1.3 68,57.55 C14.2
OSC_OUT: length 12.2
  Top Layer w0.254: U1.13 64.13,59.33 65.78,60.99 68.26,60.99 C15.2
  Top Layer w0.508: X1.1 69.55,61.73 C15.2
REFO: length 15.6
  Top Layer w0.254: C13.2 41.76,35.14 ; C13.2 39.36,38.21 ; C13.2 38.2,35.14 ; 41.76,35.14 42.26,35.14 C10.2 ; 41.76,35.14 41.75,35.16 U2.10 ; 39.36,38.21 40.13,38.21 U2.7 ; 39.36,38.21 U2.5 ; 38.2,35.14 38.25,35.19 U2.3 ; 38.2,35.14 C12.2
RIGHT: length 17.3
  Top Layer w0.254: U1.44 49.44,78.18 50.54,79.27 按键.5
RLY0: length 34.7
  Top Layer w0.254: CH1控制信号.3 81.91,56.54 81.91,63.02 81.09,63.83 U1.22
RLY1: length 26.7
  Top Layer w0.254: U1.24 65.18,64.83 66.67,66.32 86.23,66.32 86.35,66.45
RX1: length 43.9
  Top Layer w0.127: U1.69 43.13,56.33 v2(41.01,58.45) ; v2(34.66,66.7) v2(31.74,69.62)
  Bottom Layer w0.127: v2(34.66,66.7) 41.01,60.35 v2(41.01,58.45) ; v2(31.74,69.62) 26.28,69.62 24.12,67.46 8.38,67.46 串口1.2
RX2: length 37.9
  Top Layer w0.127: U1.70 42.99,55.83 42.28,56.54 38.47,56.54 36.95,55.02 v2(36.95,54.64)
  Bottom Layer w0.127: v2(36.95,54.64) 36.32,54 串口2.2
SCL1: length 6.9
  Top Layer w0.127: 54.44,51.44 54.36,51.35 54.36,47.51 54.73,47.14 56.03,47.14 56.38,46.8 U14.5
SCL2: length 14.5
  Top Layer w0.127: 55.94,51.44 55.94,50.25 61.08,45.11 64.51,45.11 66.03,43.59 66.03,43.08
SDA1: length 7.4
  Top Layer w0.127: 54.94,51.44 54.94,47.69 55.11,47.52 56.89,47.52 57.4,47.02 57.4,46.2 U14.4
SDA2: length 14.9
  Top Layer w0.127: 66.98,43.08 66.98,43.65 64.51,46.13 61.08,46.13 57.02,50.19 56.64,50.19 56.44,50.38 56.44,51.44
TCO1: length 43.2
  Top Layer w0.254: U1.51 41.75,65.33 38.98,68.1 38.98,85.62 37.59,87.02 24.5,87.02 22.22,84.73 控温.4
TCO2: length 48.6
  Top Layer w0.254: U1.52 40.09,64.83 37.71,67.21 37.71,84.99 37.33,85.37 26.66,85.37 23.23,81.94 19.23,81.94 控温.2
TP: length 37.6
  Top Layer w0.254: 18B20.2 80.89,78.51 75.31,72.92 57.4,72.92 55.94,71.47 U1.31
TX1: length 43.4
  Top Layer w0.127: v2(35.3,67.21) 32.25,70.26 ; U1.68 43.73,56.83 42.03,58.54 v2(42.03,58.7)
  Bottom Layer w0.127: 串口1.3 11.68,69.88 12.31,70.51 32.25,70.51 v2(32.38,70.38) ; v2(35.3,67.21) 42.03,60.48 v2(42.03,58.7)
TX2: length 36.8
  Top Layer w0.127: U1.71 42.86,55.33 42.16,56.03 v2(39.36,56.03)
  Bottom Layer w0.127: v2(39.36,56.03) 8.76,56.03 串口2.3
UP: length 18.9
  Top Layer w0.254: 按键.2 42.92,78.13 48,73.05 48,67.29 U1.47
VPT100: length 29.3
  Top Layer w0.508: 25.36,62.64 U17.3 ; 25.36,62.64 26.41,62.64 v3(27.68,63.91) ; 25.36,62.64 23.14,62.64 R26.1
  Bottom Layer w0.508: v3(27.68,63.91) 33.78,70 PT100.3
$1N2879: length 2.4
  Top Layer w0.254: U1.14 62.18,59.83 C9.1
$1N2903: length 3.3
  Top Layer w0.254: C21.1 47.44,69.35 U1.48
$1N2939: length 2.6
  Top Layer w0.127: 55.44,51.44 55.44,49.17 55.69,49.17 R1.1
$1N2967: length 3.2
  Top Layer w0.127: 41.46,54.64 41.76,54.33 U1.73
$1N2975: length 2.2
  Top Layer w0.254: LED1.2 75.62,58.59 R2.2
$2N471: length 25.9
  Top Layer w0.508: 电桥平衡.2 25.78,74.44 24.5,75.72 19.04,75.72 17.27,73.94 17.27,62.51 18.22,61.55 R26.2
$2N1715: length 5.9
  Top Layer w0.508: U17.2 22.12,63.92 22.09,63.95 22.06,63.98 R24.1
$2N1740: length 3.2
  Top Layer w0.254: R27.2 25.37,65.82 U17.1
$2N1747: length 3.4
  Top Layer w0.254: 28.69,67.64 30.91,65.41 U17.8
$3N343: length 2.9
  Top Layer w0.508: R33.2 55.62,39.15 U12.3
$3N344: length 10.3
  Top Layer w0.508: R32.2 56.89,39.02 U12.2 56.89,35.33 55.99,34.43 R34.1
$3N351: length 2.9
  Top Layer w0.508: U13.3 70.48,39.15 R37.2
$3N352: length 9.4
  Top Layer w0.508: R36.2 72.26,38.13 71.75,37.62 U13.2 71.62,36.71 71.62,35.08 71.23,34.69 R38.1
$3N1680: length 17.8
  Top Layer w0.254: R35.2 v4(59.42,25.56) 59.43,25.55
  Top Layer w0.508: R35.2 U18.2
  Bottom Layer w0.254: 线性度调节1.3 50.03,24.28 59.05,24.28 59.42,24.66 v4(59.42,25.56)
$3N1690: length 10.7
  Top Layer w0.254: R35.1 57.79,27.07 55.62,29.24 U12.6 55.62,32.54 55.23,32.93 R34.2
$3N1699: length 4
  Top Layer w0.508: U18.3 56.64,25.16 R29.2
$3N2013: length 15.5
  Top Layer w0.254: R39.2 76.96,25.56 U19.2 v3(76.96,20.73)
  Bottom Layer w0.254: 线性度调节2.3 68.96,20.73 v3(76.96,20.73)
$3N2020: length 3.7
  Top Layer w0.254: U19.3 75.69,25.04 R31.2
$3N2049: length 23.1
  Top Layer w0.508: U19.6 75.69,14.42 ; 75.69,14.42 75.69,9.93 垂直场+扫场.3 ; 75.69,14.42 69.8,14.42 69.21,15.01 69.21,17.93 线性度调节2.2
$3N2080: length 15.4
  Top Layer w0.254: R39.1 v1(77.08,29.49) ; U13.6 v1(70.48,29.62)
  Top Layer w0.508: U13.6 70.48,32.28 69.59,33.17 67.06,33.17 R38.2
  Bottom Layer w0.254: v1(77.08,29.49) 76.96,29.62 v1(70.48,29.62)
$3N2089: length 20.9
  Top Layer w0.508: 56.64,14.34 56.54,14.25 53.46,14.25 线性度调节1.2 ; 56.64,14.34 U18.6 ; 56.64,14.34 56.64,8.53 水平场.3

## Copper pours and planes (outline as drawn; the poured copper is in the pictures)
GND on Top Layer: -6.61,97.18 102.1,97.18 102.1,-7.59 -6.61,-7.59
GND on Bottom Layer: -5.85,98.07 101.97,98.07 101.97,-7.97 -5.85,-7.97

Small or netless copper shapes (teardrops, artwork), in the pictures only: 414 on Top Layer, 70 on Bottom Layer

## Text on the board
Top Silkscreen Layer: FD-OPMR-A3 | 2025.5.12 | +5V_1 | -5V | CLK | GND | +5V | DIO | TX1 | RX1 | TX2 | RX2 | +3V3 | TCO2 | TCO1 | VPT100 | U | D | L | R | CONF | OUT1 | CANC | A | B | G | K | OUT2 | TP | DIO-RA0 | DIO-RA1 | HC-A1 | HC-A0 | HC-B1 | HC-C1 | HC-B0 | HC-C0 | DAC1 | DAC0 | RLY0 | RLY1 | 5V_1
